# Altium schematic sheet [19]-CAMERA_PWR_CONNECTORS.SchDoc
size A4
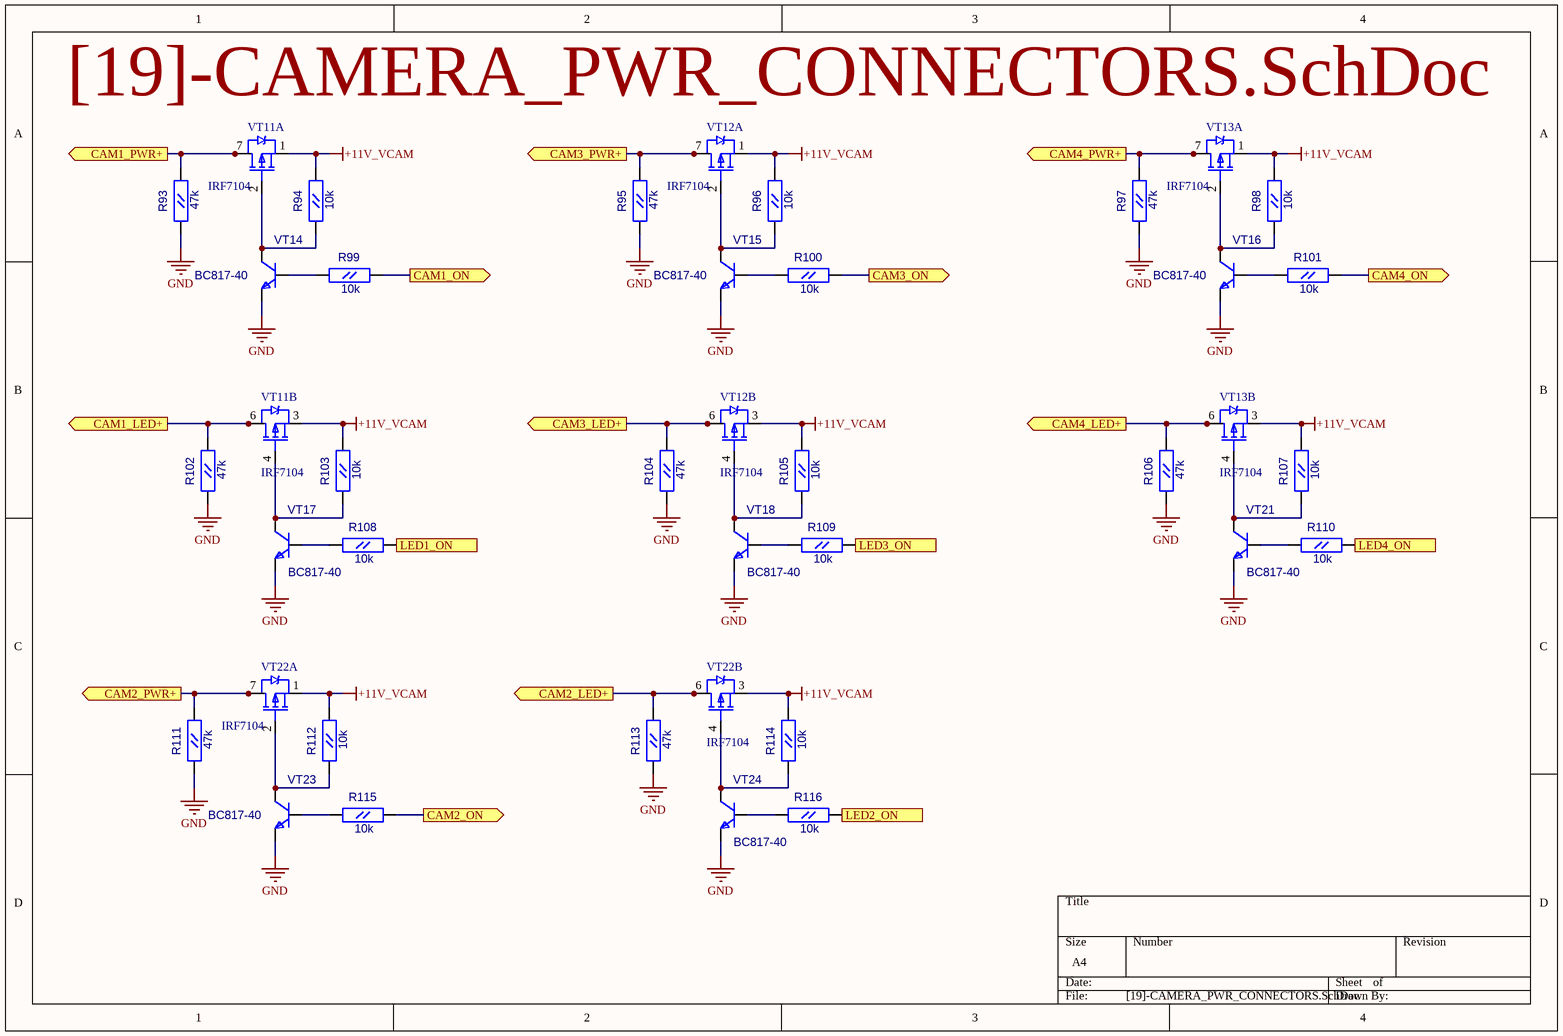
[diagram p0: [19]-CAMERA_PWR_CONNECTORS.SchDoc]

## Parts
R93  47k  [RC0603]
R94  10k  [RC0603]
R95  47k  [RC0603]
R96  10k  [RC0603]
R97  47k  [RC0603]
R98  10k  [RC0603]
R99  10k  [RC0603]
R100  10k  [RC0603]
R101  10k  [RC0603]
R102  47k  [RC0603]
R103  10k  [RC0603]
R104  47k  [RC0603]
R105  10k  [RC0603]
R106  47k  [RC0603]
R107  10k  [RC0603]
R108  10k  [RC0603]
R109  10k  [RC0603]
R110  10k  [RC0603]
R111  47k  [RC0603]
R112  10k  [RC0603]
R113  47k  [RC0603]
R114  10k  [RC0603]
R115  10k  [RC0603]
R116  10k  [RC0603]
VT11  IRF7104  [SO-8]  (parts A,B of 2)
VT12  IRF7104  [SO-8]  (parts A,B of 2)
VT13  IRF7104  [SO-8]  (parts A,B of 2)
VT14  BC817-40  [SOT-23(123)]
VT15  BC817-40  [SOT-23(123)]
VT16  BC817-40  [SOT-23(123)]
VT17  BC817-40  [SOT-23(123)]
VT18  BC817-40  [SOT-23(123)]
VT21  BC817-40  [SOT-23(123)]
VT22  IRF7104  [SO-8]  (parts A,B of 2)
VT23  BC817-40  [SOT-23(123)]
VT24  BC817-40  [SOT-23(123)]

## Ports
CAM1_LED+ (out), CAM1_ON (out), CAM1_PWR+ (out), CAM2_LED+ (out), CAM2_ON (out), CAM2_PWR+ (out), CAM3_LED+ (out), CAM3_ON (out), CAM3_PWR+ (out), CAM4_LED+ (out), CAM4_ON (out), CAM4_PWR+ (out), LED1_ON (out), LED2_ON (out), LED3_ON (out), LED4_ON (out)

## Nets
+11V_VCAM: R94.2(B) R96.2(B) R98.2(B) R103.2(B) R105.2(B) R107.2(B) R112.2(B) R114.2(B) VT11.1(S) VT11.3(S) VT12.1(S) VT12.3(S) VT13.1(S) VT13.3(S) VT22.1(S) VT22.3(S)
GND: R93.1(A) R95.1(A) R97.1(A) R102.1(A) R104.1(A) R106.1(A) R111.1(A) R113.1(A) VT14.2(E) VT15.2(E) VT16.2(E) VT17.2(E) VT18.2(E) VT21.2(E) VT23.2(E) VT24.2(E)
CAM1_LED+: R102.2(B) VT11.5 VT11.6(D) ; port CAM1_LED+
CAM1_ON: R99.2(B) ; port CAM1_ON
CAM1_PWR+: R93.2(B) VT11.7(D) VT11.8 ; port CAM1_PWR+
CAM2_LED+: R113.2(B) VT22.5 VT22.6(D) ; port CAM2_LED+
CAM2_ON: R115.2(B) ; port CAM2_ON
CAM2_PWR+: R111.2(B) VT22.7(D) VT22.8 ; port CAM2_PWR+
CAM3_LED+: R104.2(B) VT12.5 VT12.6(D) ; port CAM3_LED+
CAM3_ON: R100.2(B) ; port CAM3_ON
CAM3_PWR+: R95.2(B) VT12.7(D) VT12.8 ; port CAM3_PWR+
CAM4_LED+: R106.2(B) VT13.5 VT13.6(D) ; port CAM4_LED+
CAM4_ON: R101.2(B) ; port CAM4_ON
CAM4_PWR+: R97.2(B) VT13.7(D) VT13.8 ; port CAM4_PWR+
LED1_ON: R108.2(B) ; port LED1_ON
LED2_ON: R116.2(B) ; port LED2_ON
LED3_ON: R109.2(B) ; port LED3_ON
LED4_ON: R110.2(B) ; port LED4_ON
NetR94_1: R94.1(A) VT11.2(G) VT14.3(C)
NetR96_1: R96.1(A) VT12.2(G) VT15.3(C)
NetR98_1: R98.1(A) VT13.2(G) VT16.3(C)
NetR99_1: R99.1(A) VT14.1(B)
NetR100_1: R100.1(A) VT15.1(B)
NetR101_1: R101.1(A) VT16.1(B)
NetR103_1: R103.1(A) VT11.4(G) VT17.3(C)
NetR105_1: R105.1(A) VT12.4(G) VT18.3(C)
NetR107_1: R107.1(A) VT13.4(G) VT21.3(C)
NetR108_1: R108.1(A) VT17.1(B)
NetR109_1: R109.1(A) VT18.1(B)
NetR110_1: R110.1(A) VT21.1(B)
NetR112_1: R112.1(A) VT22.2(G) VT23.3(C)
NetR114_1: R114.1(A) VT22.4(G) VT24.3(C)
NetR115_1: R115.1(A) VT23.1(B)
NetR116_1: R116.1(A) VT24.1(B)

## Library data of the parts
R93-R116 = RC0603
  R93 R95 R97 R102 R104 R106 R111 R113: Value: 47k
  R94 R96 R98-R101 R103 R105 R107-R110 R112 R114-R116: Value: 10k
VT11-VT13 VT22 = IRF7104: Dual P-channel MOSFET. 20V,2.3A, 0.25Ohm; Value: IRF7104
VT14-VT18 VT21 VT23 VT24 = BC846BLT1: NPN 500ma transistor; ComponentField7: Published 29-Sep-2000; OriginalName: BC846BLT1; Value: BC817-40